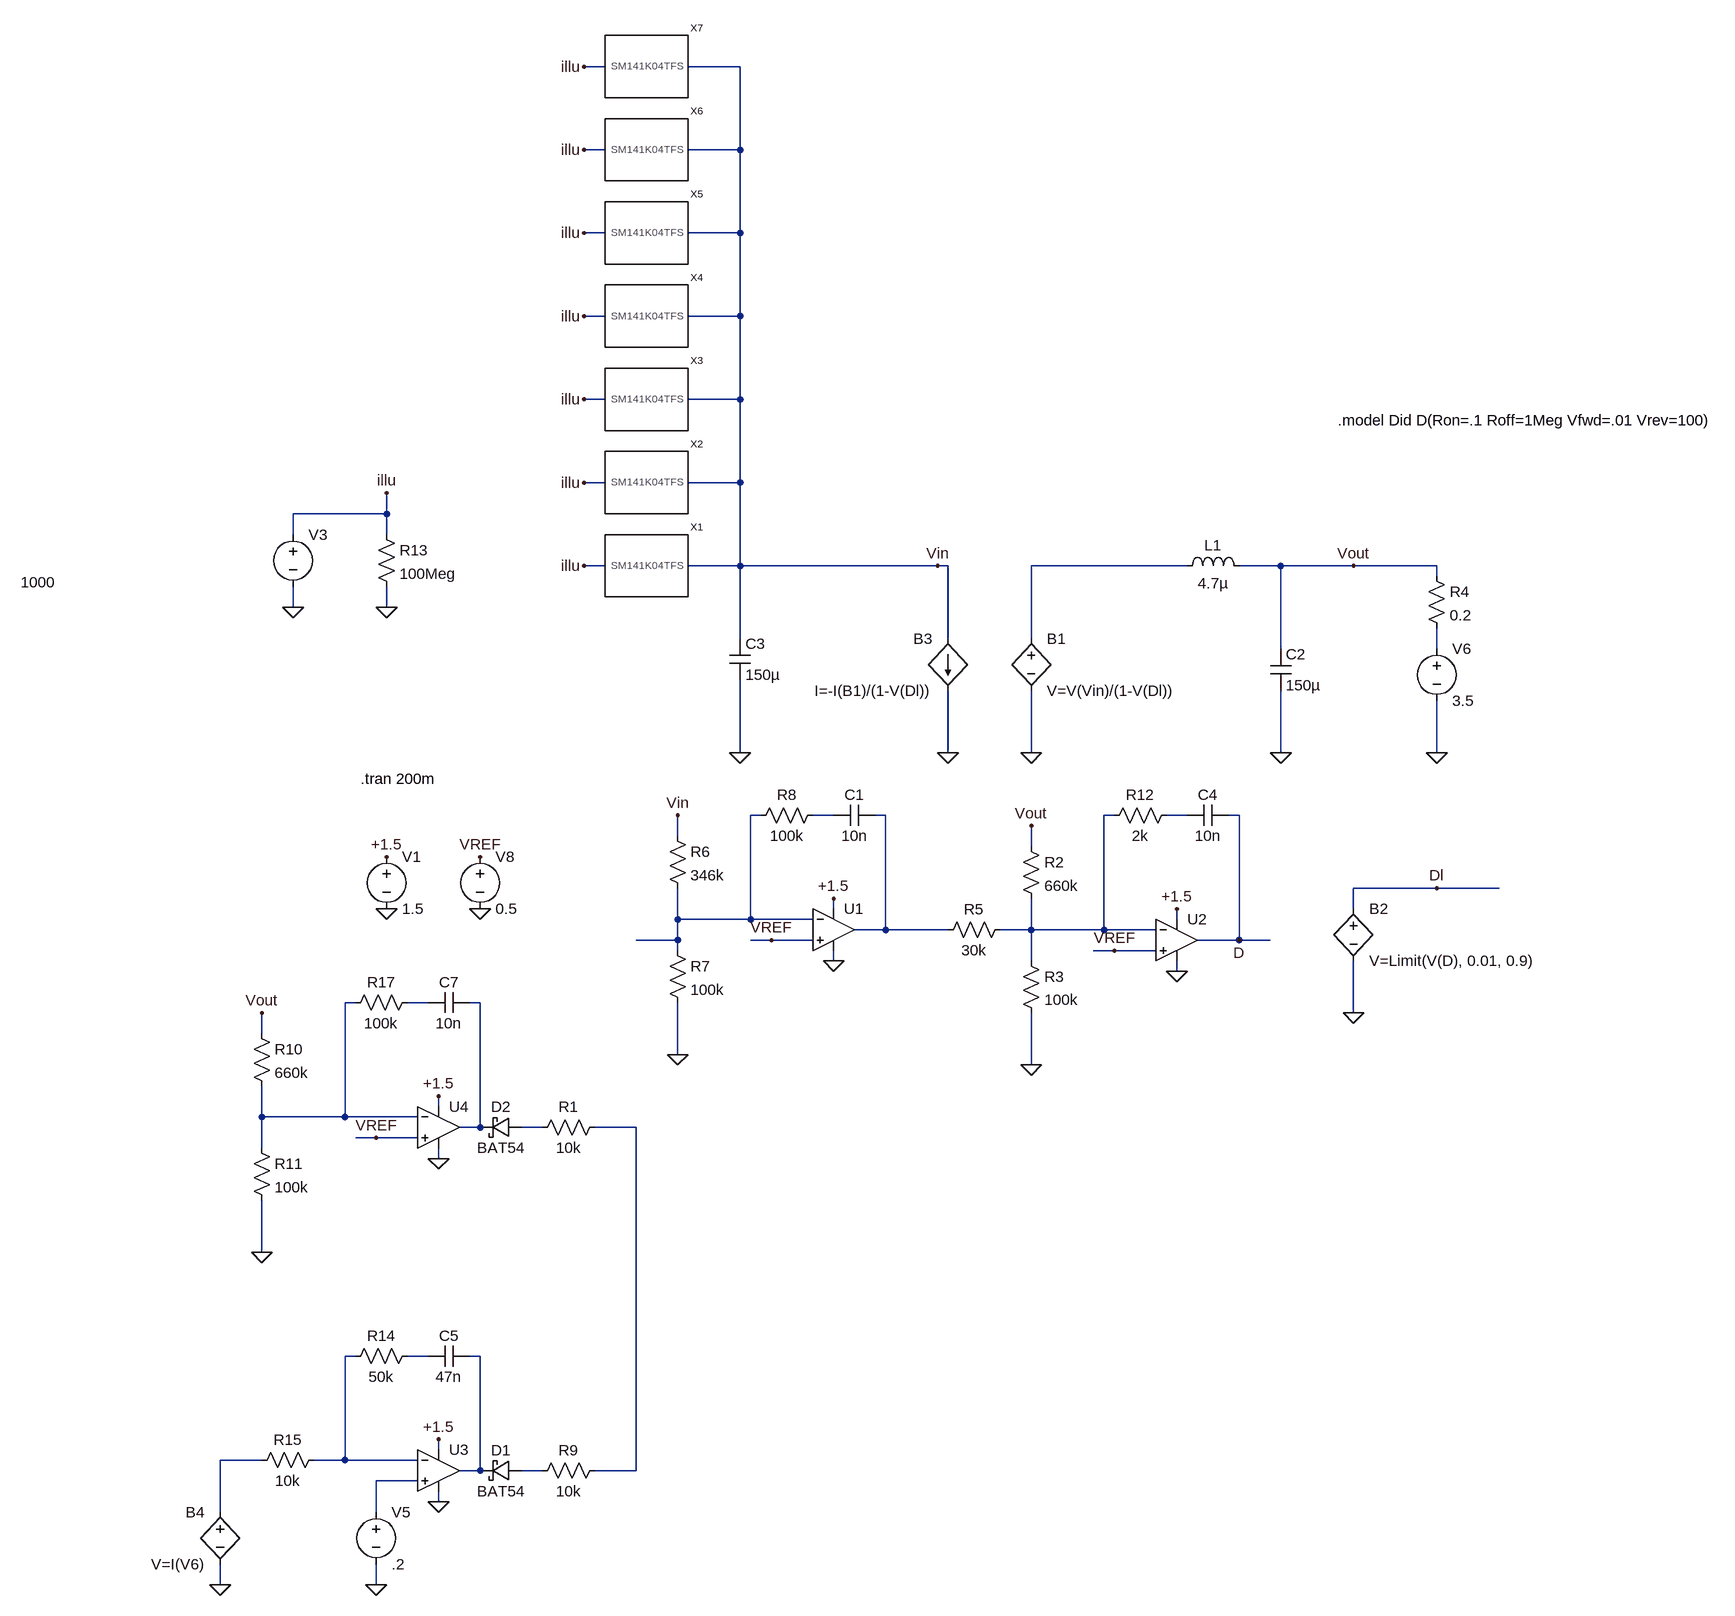
[diagram p0: schematic mppt_Draft.asc]
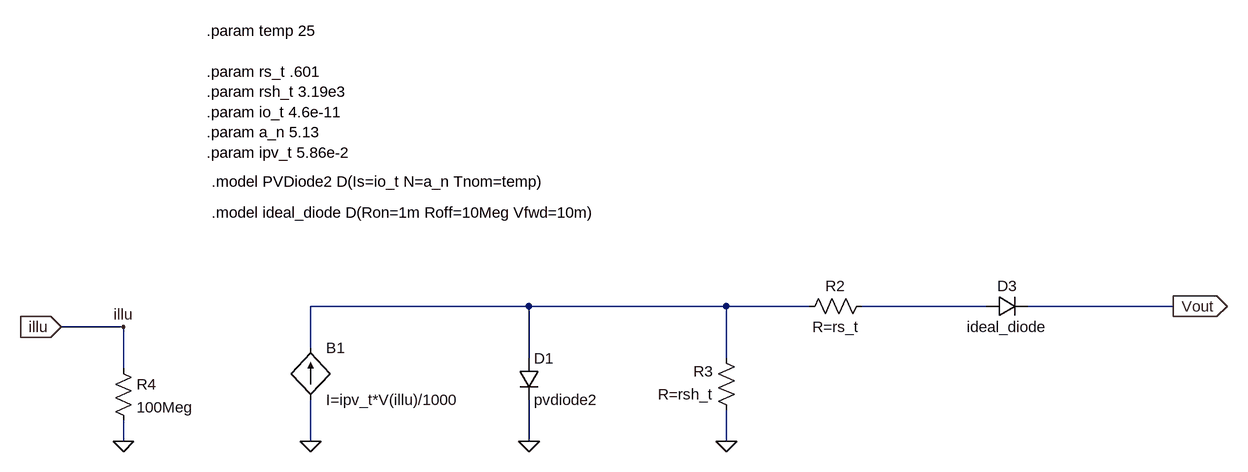
[diagram p1: sub-circuit sm141k04tfs.asc]
mppt_Draft.asc, the LTspice schematic file:
Version 4
SHEET 1 2060 1380
WIRE 160 -976 128 -976
WIRE 368 -976 288 -976
WIRE 160 -848 128 -848
WIRE 368 -848 368 -976
WIRE 368 -848 288 -848
WIRE 160 -720 128 -720
WIRE 368 -720 368 -848
WIRE 368 -720 288 -720
WIRE 160 -592 128 -592
WIRE 368 -592 368 -720
WIRE 368 -592 288 -592
WIRE 160 -464 128 -464
WIRE 368 -464 368 -592
WIRE 368 -464 288 -464
WIRE 160 -336 128 -336
WIRE 368 -336 368 -464
WIRE 368 -336 288 -336
WIRE -176 -288 -176 -320
WIRE -176 -288 -320 -288
WIRE -320 -256 -320 -288
WIRE -176 -256 -176 -288
WIRE 160 -208 128 -208
WIRE 368 -208 368 -336
WIRE 368 -208 288 -208
WIRE 672 -208 368 -208
WIRE 688 -208 672 -208
WIRE 1056 -208 816 -208
WIRE 1200 -208 1136 -208
WIRE 1312 -208 1200 -208
WIRE 1440 -208 1312 -208
WIRE 1440 -192 1440 -208
WIRE -320 -144 -320 -176
WIRE -176 -144 -176 -176
WIRE 368 -96 368 -208
WIRE 688 -96 688 -208
WIRE 816 -96 816 -208
WIRE 1200 -80 1200 -208
WIRE 1440 -80 1440 -112
WIRE 368 80 368 -32
WIRE 688 80 688 -16
WIRE 816 80 816 -16
WIRE 1200 80 1200 -16
WIRE 1440 80 1440 0
WIRE 400 176 384 176
WIRE 512 176 480 176
WIRE 592 176 576 176
WIRE 944 176 928 176
WIRE 1056 176 1024 176
WIRE 1136 176 1120 176
WIRE 272 208 272 176
WIRE 816 224 816 192
WIRE 1440 288 1312 288
WIRE 1536 288 1440 288
WIRE 512 320 512 304
WIRE 1312 320 1312 288
WIRE 272 336 272 288
WIRE 384 336 384 176
WIRE 384 336 272 336
WIRE 480 336 384 336
WIRE 1040 336 1040 320
WIRE 592 352 592 176
WIRE 592 352 544 352
WIRE 688 352 592 352
WIRE 816 352 816 304
WIRE 816 352 768 352
WIRE 928 352 928 176
WIRE 928 352 816 352
WIRE 1008 352 928 352
WIRE 272 368 272 336
WIRE 272 368 208 368
WIRE 416 368 384 368
WIRE 480 368 416 368
WIRE 1136 368 1136 176
WIRE 1136 368 1072 368
WIRE 1184 368 1136 368
WIRE 272 384 272 368
WIRE 944 384 912 384
WIRE 1008 384 944 384
WIRE 512 400 512 384
WIRE 816 400 816 352
WIRE 1040 416 1040 400
WIRE -224 464 -240 464
WIRE -112 464 -144 464
WIRE -32 464 -48 464
WIRE 1312 480 1312 400
WIRE -368 512 -368 480
WIRE 272 544 272 464
WIRE 816 560 816 480
WIRE -96 624 -96 608
WIRE -368 640 -368 592
WIRE -240 640 -240 464
WIRE -240 640 -368 640
WIRE -128 640 -240 640
WIRE -32 656 -32 464
WIRE -32 656 -64 656
WIRE 64 656 32 656
WIRE 208 656 144 656
WIRE -192 672 -224 672
WIRE -128 672 -192 672
WIRE -368 688 -368 640
WIRE -96 704 -96 688
WIRE -368 848 -368 768
WIRE -224 1008 -240 1008
WIRE -112 1008 -144 1008
WIRE -32 1008 -48 1008
WIRE -96 1152 -96 1136
WIRE -368 1168 -432 1168
WIRE -240 1168 -240 1008
WIRE -240 1168 -288 1168
WIRE -128 1168 -240 1168
WIRE -32 1184 -32 1008
WIRE -32 1184 -64 1184
WIRE 64 1184 32 1184
WIRE 208 1184 208 656
WIRE 208 1184 144 1184
WIRE -128 1200 -192 1200
WIRE -96 1232 -96 1216
WIRE -432 1248 -432 1168
WIRE -192 1248 -192 1200
WIRE -432 1360 -432 1328
WIRE -192 1360 -192 1328
FLAG 512 400 0
FLAG 512 304 +1.5
FLAG -176 320 0
FLAG -176 240 +1.5
FLAG 672 -208 Vin
FLAG 816 80 0
FLAG 1040 416 0
FLAG 1040 320 +1.5
FLAG 1136 368 D
FLAG 816 560 0
FLAG 1312 -208 Vout
FLAG 816 192 Vout
FLAG 1312 480 0
FLAG 1440 288 Dl
FLAG 1440 80 0
FLAG 688 80 0
FLAG -432 1360 0
FLAG -96 1232 0
FLAG -96 1136 +1.5
FLAG -192 1360 0
FLAG 272 544 0
FLAG 272 176 Vin
FLAG -96 704 0
FLAG -96 608 +1.5
FLAG -368 848 0
FLAG -368 480 Vout
FLAG -176 -320 illu
FLAG -176 -144 0
FLAG -320 -144 0
FLAG 128 -208 illu
FLAG 368 80 0
FLAG 128 -336 illu
FLAG 128 -464 illu
FLAG 128 -592 illu
FLAG 128 -720 illu
FLAG 128 -848 illu
FLAG 128 -976 illu
FLAG -32 320 0
FLAG -32 240 VREF
FLAG -192 672 VREF
FLAG 416 368 VREF
FLAG 944 384 VREF
FLAG 1200 80 0
SYMBOL OpAmps/UniversalOpAmp2 512 352 R0
SYMATTR InstName U1
SYMBOL Voltage -176 224 R0
SYMATTR InstName V1
SYMATTR Value 1.5
SYMBOL bv 816 -112 R0
SYMATTR InstName B1
SYMATTR Value V=V(Vin)/(1-V(Dl))
SYMBOL OpAmps/UniversalOpAmp2 1040 368 R0
SYMATTR InstName U2
SYMBOL Res 800 208 R0
SYMATTR InstName R2
SYMATTR Value 660k
SYMBOL Res 800 384 R0
SYMATTR InstName R3
SYMATTR Value 100k
SYMBOL bv 1312 304 R0
SYMATTR InstName B2
SYMATTR Value V=Limit(V(D), 0.01, 0.9)
SYMBOL bi 688 -96 M0
SYMATTR InstName B3
SYMATTR Value I=-I(B1)/(1-V(Dl))
SYMBOL Res 784 336 R90
WINDOW 0 0 56 VBottom 2
WINDOW 3 32 56 VTop 2
SYMATTR InstName R5
SYMATTR Value 30k
SYMBOL bv -432 1232 M0
SYMATTR InstName B4
SYMATTR Value V=I(V6)
SYMBOL OpAmps/UniversalOpAmp2 -96 1184 R0
SYMATTR InstName U3
SYMBOL Voltage -192 1232 R0
WINDOW 123 0 0 Left 0
WINDOW 39 0 0 Left 0
SYMATTR InstName V5
SYMATTR Value .2
SYMBOL Res 256 192 R0
SYMATTR InstName R6
SYMATTR Value 346k
SYMBOL Res 256 368 R0
SYMATTR InstName R7
SYMATTR Value 100k
SYMBOL Voltage 1440 -96 R0
SYMATTR InstName V6
SYMATTR Value 3.5
SYMBOL Res 1424 -208 R0
SYMATTR InstName R4
SYMATTR Value 0.2
SYMBOL OpAmps/UniversalOpAmp2 -96 656 R0
SYMATTR InstName U4
SYMBOL Res -384 496 R0
SYMATTR InstName R10
SYMATTR Value 660k
SYMBOL Res -384 672 R0
SYMATTR InstName R11
SYMATTR Value 100k
SYMBOL SM141K04TFS 224 -208 R0
SYMATTR InstName X1
SYMBOL res -192 -272 R0
SYMATTR InstName R13
SYMATTR Value 100Meg
SYMBOL voltage -320 -272 R0
WINDOW 3 -419 89 Left 2
WINDOW 123 0 0 Left 0
WINDOW 39 0 0 Left 0
SYMATTR InstName V3
SYMATTR Value 1000
SYMBOL cap 352 -96 R0
SYMATTR InstName C3
SYMATTR Value 150µ
SYMATTR SpiceLine Rser=10m
SYMBOL SM141K04TFS 224 -336 R0
SYMATTR InstName X2
SYMBOL SM141K04TFS 224 -464 R0
SYMATTR InstName X3
SYMBOL SM141K04TFS 224 -592 R0
SYMATTR InstName X4
SYMBOL SM141K04TFS 224 -720 R0
SYMATTR InstName X5
SYMBOL schottky 32 640 R90
WINDOW 0 0 32 VBottom 2
WINDOW 3 32 32 VTop 2
SYMATTR InstName D2
SYMATTR Value BAT54
SYMATTR Description Diode
SYMATTR Type diode
SYMBOL Res 160 640 R90
WINDOW 0 0 56 VBottom 2
WINDOW 3 32 56 VTop 2
SYMATTR InstName R1
SYMATTR Value 10k
SYMBOL SM141K04TFS 224 -848 R0
SYMATTR InstName X6
SYMBOL SM141K04TFS 224 -976 R0
SYMATTR InstName X7
SYMBOL Voltage -32 224 R0
WINDOW 123 0 0 Left 0
WINDOW 39 0 0 Left 0
SYMATTR InstName V8
SYMATTR Value 0.5
SYMBOL schottky 32 1168 R90
WINDOW 0 0 32 VBottom 2
WINDOW 3 32 32 VTop 2
SYMATTR InstName D1
SYMATTR Value BAT54
SYMATTR Description Diode
SYMATTR Type diode
SYMBOL Res 160 1168 R90
WINDOW 0 0 56 VBottom 2
WINDOW 3 32 56 VTop 2
SYMATTR InstName R9
SYMATTR Value 10k
SYMBOL res 496 160 R90
WINDOW 0 0 56 VBottom 2
WINDOW 3 32 56 VTop 2
SYMATTR InstName R8
SYMATTR Value 100k
SYMBOL cap 576 160 R90
WINDOW 0 0 32 VBottom 2
WINDOW 3 32 32 VTop 2
SYMATTR InstName C1
SYMATTR Value 10n
SYMBOL ind 1040 -192 R270
WINDOW 0 32 56 VTop 2
WINDOW 3 5 56 VBottom 2
SYMATTR InstName L1
SYMATTR Value 4.7µ
SYMATTR SpiceLine Rser=30m
SYMBOL cap 1184 -80 R0
SYMATTR InstName C2
SYMATTR Value 150µ
SYMATTR SpiceLine Rser=10m
SYMBOL res 1040 160 R90
WINDOW 0 0 56 VBottom 2
WINDOW 3 32 56 VTop 2
SYMATTR InstName R12
SYMATTR Value 2k
SYMBOL cap 1120 160 R90
WINDOW 0 0 32 VBottom 2
WINDOW 3 32 32 VTop 2
SYMATTR InstName C4
SYMATTR Value 10n
SYMBOL res -128 992 R90
WINDOW 0 0 56 VBottom 2
WINDOW 3 32 56 VTop 2
SYMATTR InstName R14
SYMATTR Value 50k
SYMBOL cap -48 992 R90
WINDOW 0 0 32 VBottom 2
WINDOW 3 32 32 VTop 2
SYMATTR InstName C5
SYMATTR Value 47n
SYMBOL res -272 1152 R90
WINDOW 0 0 56 VBottom 2
WINDOW 3 32 56 VTop 2
SYMATTR InstName R15
SYMATTR Value 10k
SYMBOL res -128 448 R90
WINDOW 0 0 56 VBottom 2
WINDOW 3 32 56 VTop 2
SYMATTR InstName R17
SYMATTR Value 100k
SYMBOL cap -48 448 R90
WINDOW 0 0 32 VBottom 2
WINDOW 3 32 32 VTop 2
SYMATTR InstName C7
SYMATTR Value 10n
TEXT -216 120 Left 2 !.tran 200m
TEXT 1288 -432 Left 2 !.model Did D(Ron=.1 Roff=1Meg Vfwd=.01 Vrev=100)

sm141k04tfs.asc, the sub-circuit schematic file:
Version 4
SHEET 1 1228 692
WIRE 64 80 -272 80
WIRE 368 80 64 80
WIRE 496 80 368 80
WIRE 768 80 576 80
WIRE 1056 80 832 80
WIRE -560 112 -656 112
WIRE -272 144 -272 80
WIRE 64 160 64 80
WIRE 368 160 368 80
WIRE -560 176 -560 112
WIRE -560 288 -560 256
WIRE -272 288 -272 224
WIRE 64 288 64 224
WIRE 368 288 368 240
FLAG 368 288 0
FLAG 64 288 0
FLAG -272 288 0
FLAG 1056 80 Vout
IOPIN 1056 80 Out
FLAG -656 112 illu
IOPIN -656 112 In
FLAG -560 112 illu
FLAG -560 288 0
SYMBOL res 592 64 R90
WINDOW 0 0 56 VBottom 2
WINDOW 3 32 56 VTop 2
SYMATTR InstName R2
SYMATTR Value R=rs_t
SYMBOL res 384 256 R180
WINDOW 0 36 76 Left 2
WINDOW 3 36 40 Left 2
SYMATTR InstName R3
SYMATTR Value R=rsh_t
SYMBOL diode 48 160 R0
SYMATTR InstName D1
SYMATTR Value pvdiode2
SYMBOL bi2 -272 144 R0
SYMATTR InstName B1
SYMATTR Value I=ipv_t*V(illu)/1000
SYMBOL diode 768 96 R270
WINDOW 0 32 32 VTop 2
WINDOW 3 0 32 VBottom 2
SYMATTR InstName D3
SYMATTR Value ideal_diode
SYMBOL res -576 160 R0
SYMATTR InstName R4
SYMATTR Value 100Meg
TEXT -424 -112 Left 2 !.model PVDiode2 D(Is=io_t N=a_n Tnom=temp)
TEXT -432 -344 Left 2 !.param temp 25\n \n.param rs_t .601\n.param rsh_t 3.19e3\n.param io_t 4.6e-11\n.param a_n 5.13\n.param ipv_t 5.86e-2
TEXT -424 -64 Left 2 !.model ideal_diode D(Ron=1m Roff=10Meg Vfwd=10m)

The netlist it stands for:
* mppt_Draft.asc
XU1 VREF N003 +1.5 0 N005 level2 Avol=1Meg GBW=10Meg Slew=10Meg Ilimit=25m Rail=0 Vos=0 En=0 Enk=0 In=0 Ink=0 Rin=500Meg  ; pins In+ In- V+ V- OUT
V1 +1.5 0 1.5
B1 N001 0 V=V(Vin)/(1-V(Dl))
XU2 VREF N006 +1.5 0 D level2 Avol=1Meg GBW=10Meg Slew=10Meg Ilimit=25m Rail=0 Vos=0 En=0 Enk=0 In=0 Ink=0 Rin=500Meg  ; pins In+ In- V+ V- OUT
R2 Vout N006 660k
R3 N006 0 100k
B2 Dl 0 V=Limit(V(D), 0.01, 0.9)
B3 Vin 0 I=-I(B1)/(1-V(Dl))
R5 N006 N005 30k
B4 N016 0 V=I(V6)
XU3 N018 N013 +1.5 0 N015 level2 Avol=1Meg GBW=10Meg Slew=10Meg Ilimit=25m Rail=0 Vos=0 En=0 Enk=0 In=0 Ink=0 Rin=500Meg  ; pins In+ In- V+ V- OUT
V5 N018 0 .2
R6 Vin N003 346k
R7 N003 0 100k
V6 N002 0 3.5
R4 Vout N002 0.2
XU4 VREF N008 +1.5 0 N010 level2 Avol=1Meg GBW=10Meg Slew=10Meg Ilimit=25m Rail=0 Vos=0 En=0 Enk=0 In=0 Ink=0 Rin=500Meg  ; pins In+ In- V+ V- OUT
R10 Vout N008 660k
R11 N008 0 100k
XX1 illu Vin sm141k04tfs
R13 illu 0 100Meg
V3 illu 0 1000
C3 Vin 0 150µ Rser=10m
XX2 illu Vin sm141k04tfs
XX3 illu Vin sm141k04tfs
XX4 illu Vin sm141k04tfs
XX5 illu Vin sm141k04tfs
D2 N011 N010 BAT54
R1 N012 N011 10k
XX6 illu Vin sm141k04tfs
XX7 illu Vin sm141k04tfs
V8 VREF 0 0.5
D1 N017 N015 BAT54
R9 N012 N017 10k
R8 N004 N003 100k
C1 N005 N004 10n
L1 N001 Vout 4.7µ Rser=30m
C2 Vout 0 150µ Rser=10m
R12 N007 N006 2k
C4 D N007 10n
R14 N014 N013 50k
C5 N015 N014 47n
R15 N013 N016 10k
R17 N009 N008 100k
C7 N010 N009 10n

* block symbol definitions
.subckt sm141k04tfs Illu Vout
R2 N002 N001 R=rs_t
R3 0 N001 R=rsh_t
D1 N001 0 pvdiode2
B1 0 N001 I=ipv_t*V(illu)/1000
D3 N002 Vout ideal_diode
R4 illu 0 100Meg
.model PVDiode2 D(Is=io_t N=a_n Tnom=temp)
.param temp 25
.param rs_t .601
.param rsh_t 3.19e3
.param io_t 4.6e-11
.param a_n 5.13
.param ipv_t 5.86e-2
.model ideal_diode D(Ron=1m Roff=10Meg Vfwd=10m)
.ends sm141k04tfs

.model D D
.lib standard.dio
.tran 200m
.model Did D(Ron=.1 Roff=1Meg Vfwd=.01 Vrev=100)
.lib UniversalOpAmp2.lib
.backanno
.end